# Altium schematic sheet ESP32.SchDoc
size A4; DrawnBy: Emile Renaud; Revision: V1.0; SheetNumber: 3; SheetTotal: 8
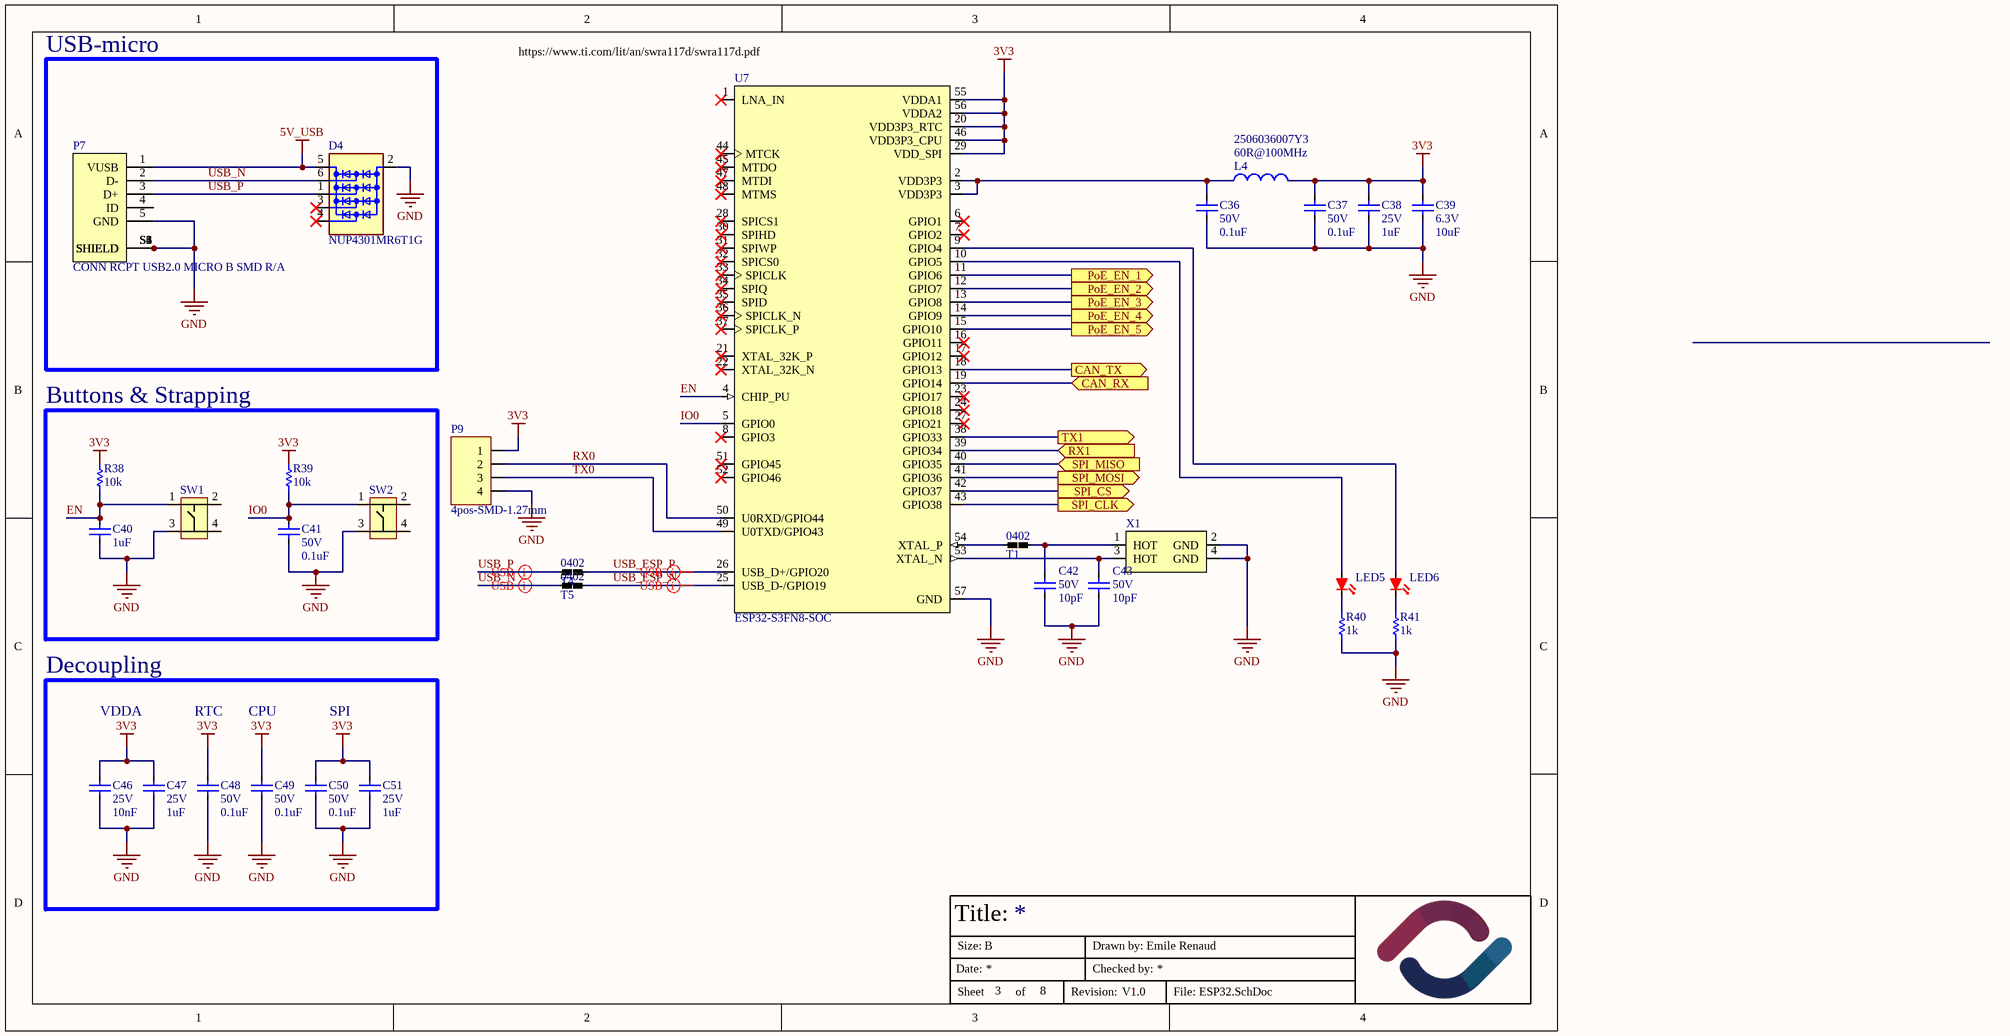
[diagram p0: ESP32.SchDoc]

## Parts
C36  value 0.1uF  Volt: 50V  [CAPACITOR-0603]  (hidden comment: Capacitor-0603-0.1uF-50V-X7R)
C37  value 0.1uF  Volt: 50V  [CAPACITOR-0603]  (hidden comment: Capacitor-0603-0.1uF-50V-X7R)
C38  value 1uF  Volt: 25V  [CAPACITOR-0603]  (hidden comment: Capacitor-0603-1uF-25V-X5R)
C39  value 10uF  Volt: 6.3V  [CAPACITOR-0603]  (hidden comment: Capacitor-0603-10uF-6.3V-X5R)
C40  value 1uF  [CAPACITOR-0603]  (hidden comment: Capacitor-0603-1uF-25V-X5R)
C41  value 0.1uF  Volt: 50V  [CAPACITOR-0603]  (hidden comment: Capacitor-0603-0.1uF-50V-X7R)
C42  value 10pF  Volt: 50V  [CAPACITOR-0402]  (hidden comment: Capacitor-0402-10pF-50V-C0G)
C43  value 10pF  Volt: 50V  [CAPACITOR-0402]  (hidden comment: Capacitor-0402-10pF-50V-C0G)
C46  value 10nF  Volt: 25V  [CAPACITOR-0603]  (hidden comment: Capacitor-0603-10nF-25V-X5R)
C47  value 1uF  Volt: 25V  [CAPACITOR-0603]  (hidden comment: Capacitor-0603-1uF-25V-X5R)
C48  value 0.1uF  Volt: 50V  [CAPACITOR-0603]  (hidden comment: Capacitor-0603-0.1uF-50V-X7R)
C49  value 0.1uF  Volt: 50V  [CAPACITOR-0603]  (hidden comment: Capacitor-0603-0.1uF-50V-X7R)
C50  value 0.1uF  Volt: 50V  [CAPACITOR-0603]  (hidden comment: Capacitor-0603-0.1uF-50V-X7R)
C51  value 1uF  Volt: 25V  [CAPACITOR-0603]  (hidden comment: Capacitor-0603-1uF-25V-X5R)
D4  NUP4301MR6T1G  [SOT-23-6]
L4  2506036007Y3  value 60R@100MHz  [CAPACITOR-0603]
LED5  B1911USD-20D000114U1930  [LED-0603-2PIN]  (value not drawn)
LED6  B1911USD-20D000114U1930  [LED-0603-2PIN]  (value not drawn)
P7  CONN RCPT USB2.0 MICRO B SMD R/A  [FCI_10118193-0001LF]
P9  4pos-SMD-1.27mm  [HDR1X4-SMD-50mils]
R38  value 10k  [Resistor-0603]  (hidden comment: SMT resistor)
R39  value 10k  [Resistor-0603]  (hidden comment: SMT resistor)
R40  value 1k  [Resistor-0603]  (hidden comment: SMT resistor)
R41  value 1k  [Resistor-0603]  (hidden comment: SMT resistor)
SW1  PTS815 SJM 250 SMTR LFS  [SW4_PTS815 SJM 250 SMTR LFS_CNK]  (value not drawn)
SW2  PTS815 SJM 250 SMTR LFS  [SW4_PTS815 SJM 250 SMTR LFS_CNK]  (value not drawn)
T1  NetTie_0402  [NetTie-0402]  (value not drawn)
T4  NetTie_0402  [NetTie-0402]  (value not drawn)
T5  NetTie_0402  [NetTie-0402]  (value not drawn)
U7  ESP32-S3FN8-SOC  [VFQFN-56 Exposed Pad]
X1  CX2016DB40000D0FLJCC  [4-SMD]  (value not drawn)

## Blocks framed on the sheet
USB-micro: D4 P7
Buttons & Strapping: C40 C41 R38 R39 SW1 SW2
Decoupling: C46-C51

## Ports
CAN_RX (in), CAN_TX (out), PoE_EN_1 (out), PoE_EN_2 (out), PoE_EN_3 (out), PoE_EN_4 (out), PoE_EN_5 (out), RX1 (in), SPI_CLK (out), SPI_CS (out), SPI_MISO (in), SPI_MOSI (out), TX1 (out)

## Nets
3V3: C37.2 C38.2 C39.2 C46.2 C47.2 C48.2 C49.2 C50.2 C51.2 L4.2 P9.1 R38.2 R39.2 U7.20(VDD3P3_RTC) U7.29(VDD_SPI) U7.46(VDD3P3_CPU) U7.55(VDDA1) U7.56(VDDA2)
5V_USB: D4.5(VDD) P7.1(VUSB)
GND: C36.1 C37.1 C38.1 C39.1 C40.1 C41.1 C42.1 C43.1 C46.1 C47.1 C48.1 C49.1 C50.1 C51.1 D4.2(GND) P7.5(GND) P7.S1(SHIELD) P7.S2(SHIELD) P7.S3(SHIELD) P7.S4(SHIELD) P7.S5(SHIELD) P7.S6(SHIELD) P9.4 R40.1 R41.1 SW1.3 SW2.3 U7.57(GND) X1.2(GND) X1.4(GND)
CAN_RX: U7.19(GPIO14) ; port CAN_RX
CAN_TX: U7.18(GPIO13) ; port CAN_TX
EN: C40.2 R38.1 SW1.1 U7.4(CHIP_PU)
IO0: C41.2 R39.1 SW2.1 U7.5(GPIO0)
PoE_EN_1: U7.11(GPIO6) ; port PoE_EN_1
PoE_EN_2: U7.12(GPIO7) ; port PoE_EN_2
PoE_EN_3: U7.13(GPIO8) ; port PoE_EN_3
PoE_EN_4: U7.14(GPIO9) ; port PoE_EN_4
PoE_EN_5: U7.15(GPIO10) ; port PoE_EN_5
RX0: P9.2 U7.50(U0RXD/GPIO44)
RX1: U7.39(GPIO34) ; port RX1
SPI_CLK: U7.43(GPIO38) ; port SPI_CLK
SPI_CS: U7.42(GPIO37) ; port SPI_CS
SPI_MISO: U7.40(GPIO35) ; port SPI_MISO
SPI_MOSI: U7.41(GPIO36) ; port SPI_MOSI
TX0: P9.3 U7.49(U0TXD/GPIO43)
TX1: U7.38(GPIO33) ; port TX1
USB_ESP_N: T5.1 U7.25(USB_D-/GPIO19)
USB_ESP_P: T4.1 U7.26(USB_D+/GPIO20)
USB_N: D4.6(L1) P7.2(D-) T5.2
USB_P: D4.1(L2) P7.3(D+) T4.2
NetC36_2: C36.2 L4.1 U7.2(VDD3P3) U7.3(VDD3P3)
NetC42_2: C42.2 T1.1 X1.1(HOT)
NetC43_2: C43.2 U7.53(XTAL_N) X1.3(HOT)
NetLED5_1: LED5.1(K) R40.2
NetLED5_2: LED5.2(R) U7.10(GPIO5)
NetLED6_1: LED6.1(K) R41.2
NetLED6_2: LED6.2(R) U7.9(GPIO4)
NetT1_2: T1.2 U7.54(XTAL_P)

Not connected (* = marked no-connect by the designer): D4 3(L3)* 4(L4)*; P7 4(ID); SW1 2 4; SW2 2 4; U7 1(LNA_IN)* 6(GPIO1)* 7(GPIO2)* 8(GPIO3)* 16(GPIO11)* 17(GPIO12)* 21(XTAL_32K_P)* 22(XTAL_32K_N)* 23(GPIO17)* 24(GPIO18)* 27(GPIO21)* 28(SPICS1)* 30(SPIHD)* 31(SPIWP)* 32(SPICS0)* 33(SPICLK)* 34(SPIQ)* 35(SPID)* 36(SPICLK_N)* 37(SPICLK_P)* 44(MTCK)* 45(MTDO)* 47(MTDI)* 48(MTMS)* 51(GPIO45)* 52(GPIO46)*

## Layout directives
differential pair; differential pair class USB: USB_ESP_N, USB_ESP_P, USB_N, USB_P

## Notes on the sheet
- (near U7) https://www.ti.com/lit/an/swra117d/swra117d.pdf
- VDDA
- RTC
- CPU
- SPI
- Title:
- Date:
- Size:
- B
- Drawn by:
- Checked by:
- Sheet
- of
- Revision:
- File:
- (in symbol NetTie_0402) 0402

## Library data of the parts
C36 C37 C41 C48-C50 = Capacitor-0603-0.1uF-50V-X7R: Precision: X7R-10%; Package / Case: Metric 1608, EIA 0603; Mounted: Yes; Supplier 1: Digi-Key; Supplier Part Number 1: 1276-1935-2-ND; Supplier 2: Digi-Key; Supplier Part Number 2: 1276-1934-2-ND
C38 C47 C51 = Capacitor-0603-1uF-25V-X5R: Precision: X5R-10%; Package / Case: Metric 1608, EIA 0603; Mounted: Yes; Supplier 1: Digi-Key; Supplier Part Number 1: 1276-1859-2-ND; Supplier 2: Digi-Key; Supplier Part Number 2: 1276-1942-2-ND
C39 = Capacitor-0603-10uF-6.3V-X5R: Capacitor-0603-10uF-6.3V-X5R, Low ESR, Low ESL; Precision: X5R-20%; Supplier 1: Arrow Electronics; Supplier Part Number 1: NMC0603X5R106M6.3TRP4KF; Mounted: Yes; Package / Case: Metric 1608 , EIA 0603
C40 = Capacitor-0603-1uF-25V-X5R: Precision: X5R-10%; Volt: 25V; Package / Case: Metric 1608, EIA 0603; Mounted: Yes; Supplier 1: Digi-Key; Supplier Part Number 1: 1276-1859-2-ND; Supplier 2: Digi-Key; Supplier 3: Digi-Key; Supplier 4: Digi-Key; Supplier Part Number 2: 1276-1942-2-ND
C42 C43 = Capacitor-0402-10pF-50V-C0G: Precision: C0G - 10%; Package / Case: 0402 (1005 Metric); Mounted: Yes; Supplier 1: Digi-Key; Supplier Part Number 1: 399-C0402C100K5GAC7867CT-ND; Supplier 2: Digi-Key; HelpURL: https://connect.kemet.com:7667/gateway/IntelliData-ComponentDocumentation/1.0/download/datasheet/C0402C100K5GACTU
C46 = Capacitor-0603-10nF-25V-X5R: 10000 pF ±10% 25V Ceramic Capacitor X5R 0603 (1608 Metric); Precision: X5R-10%; Mounted: Yes; Package / Case: Metric 1608 , EIA 0603; Supplier 1: Digikey; Supplier Part Number 1: 478-KGM15AR51E103KTCT-ND
D4 = NUP4301MR6T1G: 4CH Clamp Ipp Tvs Diode Surface Mount SOT23-6 (SC74); Volt: 70; Supplier 1: Digi-Key; Supplier Part Number 1: NUP4301MR6T1GOSTR-ND; Mounted: Yes; Package / Case: SOT23-6
L4 = 2506036007Y3: 60 Ohms @ 100 MHz 1 Signal Line Ferrite Bead 0603 (1608 Metric) 3A 40mOhm; Supplier 1: Digi-Key; Mounted: Yes; Supplier Part Number 1: 1934-1396-1-ND; Package / Case: SMD; Current: 3A
LED5 LED6 = B1911USD-20D000114U1930: LED RED CLEAR 1608 SMD; Package / Case: 0603 (1608 Metric); Mounted: Yes; Supplier 1: Digi-Key; Supplier Part Number 1: 3147-B1911USD-20D000114U1930CT-ND
P7 = USB-Micro: USB - micro B USB 2.0 Receptacle Connector 5 Position Surface Mount, Right Angle; Through Hole; Supplier 1: Digikey; Supplier Part Number 1: 609-4616-2-ND; Mounted: Yes; Package / Case: SMD; Volt: N/A
P9 = 4pos-SMD-1.27mm: 4pos SMD 1.27mm; Supplier 1: Digi-Key; Supplier Part Number 1: N/A; Mounted: Yes; Package / Case: TH; Volt: N/A
R38 R39 = Resistor0603-10k: Precision: 1%; Watt: 0.1W; Mounted: Yes; Package / Case: Metric 1608, EIA 0603; Supplier 2: Digi-Key; Supplier 4: Digi-Key; Supplier Part Number 2: RMCF0603FT10K0TR-ND; Supplier 1: Digi-Key; Supplier 3: Digi-Key; Supplier Part Number 1: 311-10.0KHRTR-ND
R40 R41 = Resistor-0603-1k: Resistor0603-1k; Precision: 1%; Watt: 0.1W; Mounted: Yes; Package / Case: Metric 1608, EIA 0603; Supplier 1: Digi-Key; Supplier Part Number 1: 311-1.00KHRCT-ND
SW1 SW2 = PTS815 SJM 250 SMTR LFS: TACT 4.2 X 3.2, 2.5 MM H, 180GF,; Volt: 12V; Current: 0.05A; Supplier 1: Digi-Key; Supplier Part Number 1: CKN12215-1-ND; Mounted: Yes
U7 = ESP32-S3FN8-SOC: IC RF TxRx + MCU Bluetooth, WiFi 802.11b/g/n, Bluetooth v5.0 2.412GHz ~ 2.484GHz 56-VFQFN Exposed Pad; MF: Espressif Systems; Availability: In Stock; MP: ESP32-S3FN8; Package: 56-VFQFN Exposed Pad; DigiKey Link: https://www.digikey.ca/en/products/detail/espressif-systems/ESP32-S3FN8/15822446; HelpURL: https://www.espressif.com/sites/default/files/documentation/esp32-s3_datasheet_en.pdf; Supplier 1: Digikey; Supplier Part Number 1: 1965-ESP32-S3FN8-ND
X1 = CX2016DB40000D0FLJCC: 40 MHz ±10ppm Crystal 8pF 50 Ohms 4-SMD, No Lead; Supplier 1: Digikey; Supplier Part Number 1: 478-CX2016DB40000D0FLJCCCT-ND; Parameter 1: *